# EAGLE design manual (EAGLE 4.16)
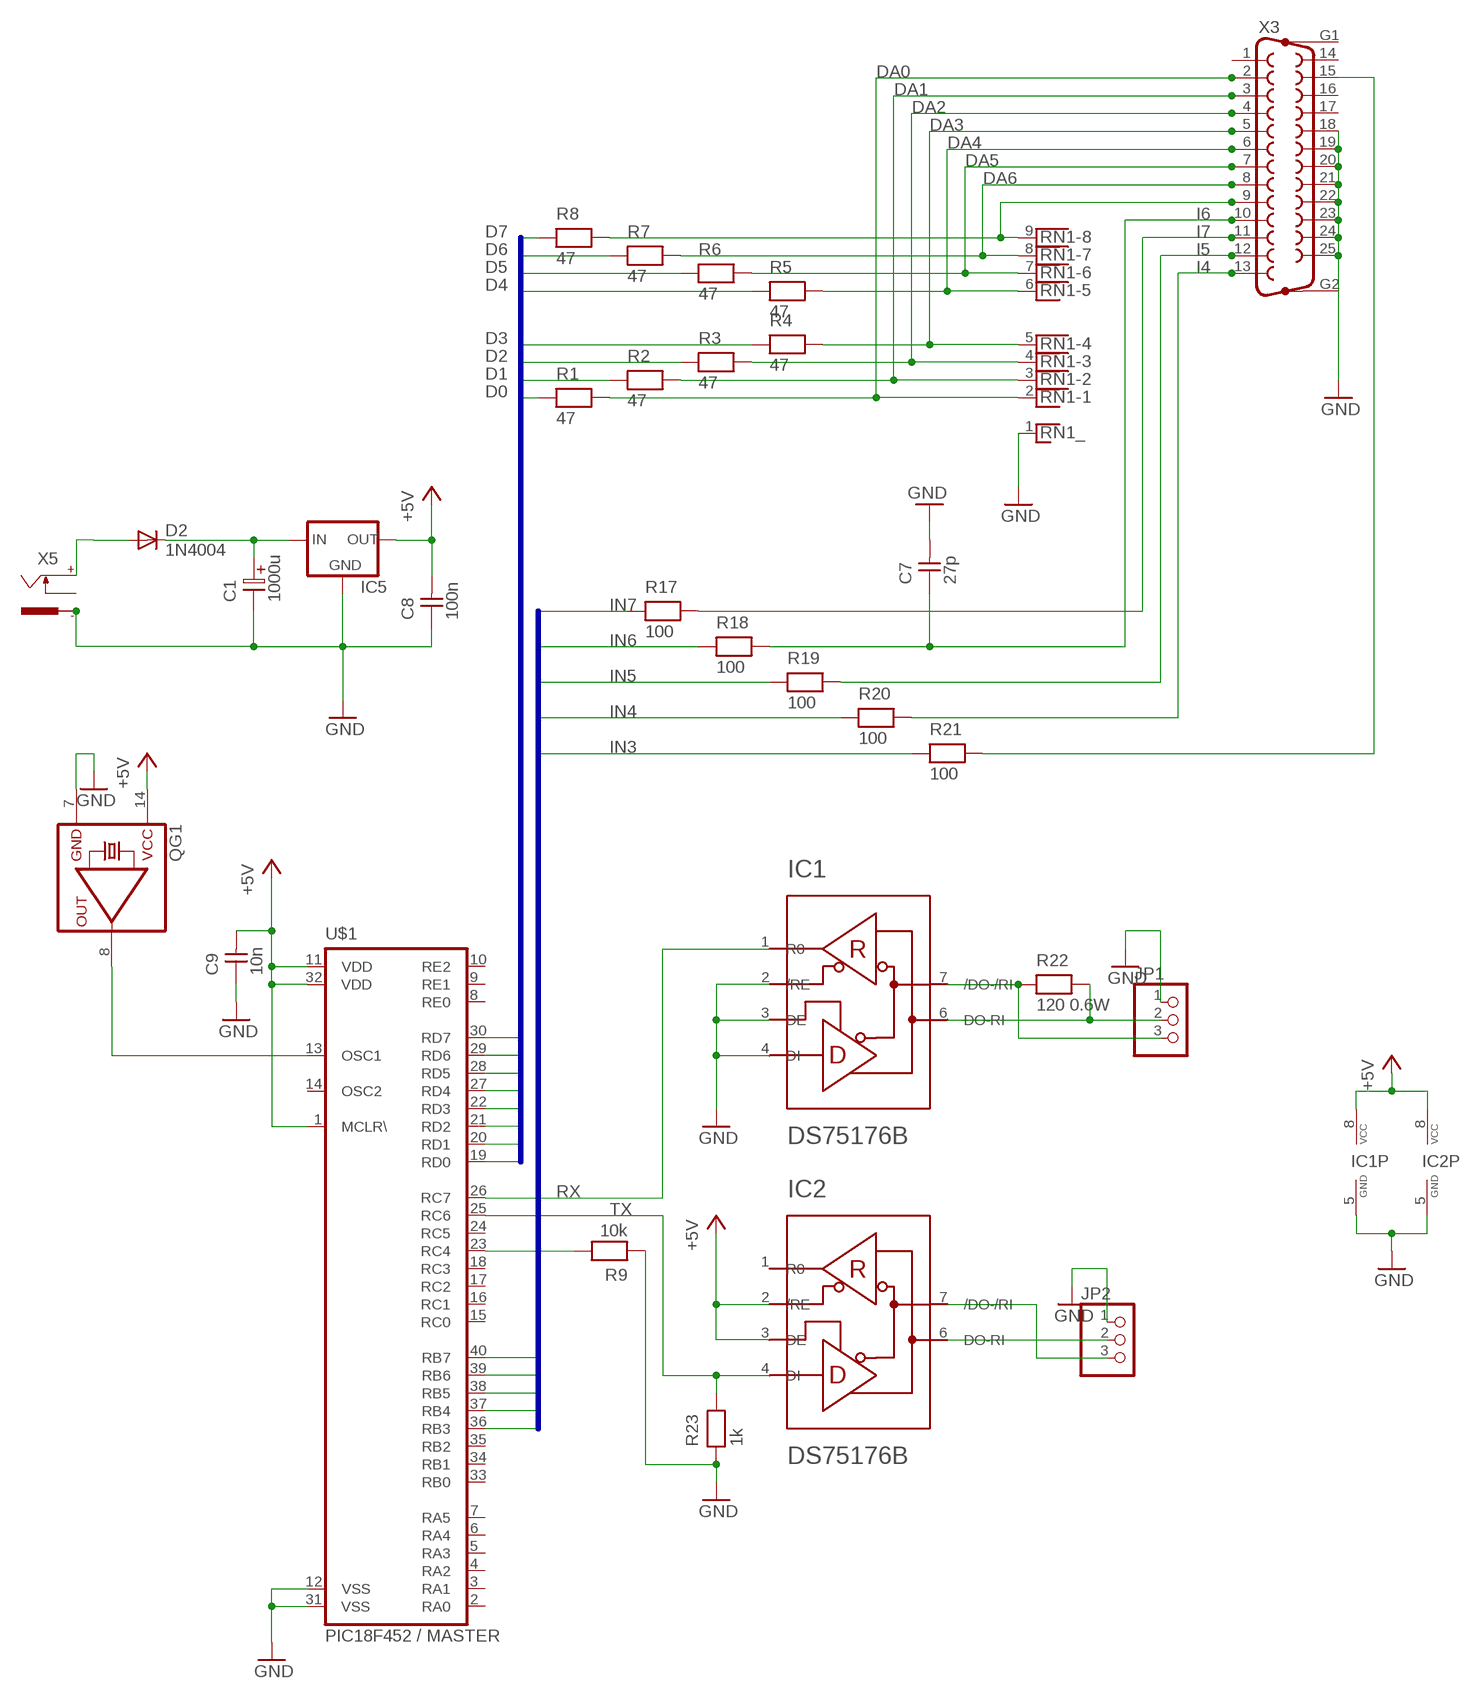
[diagram p0: schematic, sheet 1]

## Parts
C1  1000u  ELC-5  [ES-5]
C7  27p  CAPNP-2,5  [C-2,5]
C8  100n  CAPNP-2,5  [C-2,5]
C9  10n  CAPNP-2,5  [C-2,5]
D2  1N4004  [DO41-10]
IC1  DS75176B  [DIL08]
IC2  DS75176B  [DIL08]
IC5  78XXS  [78XXS]
JP1  PINHD-1X3  [1X03]
JP2  PINHD-1X3  [1X03]
QG1  QG5860  [DIL14S]
R1  47  RESEU-10  [R-10]
R2  47  RESEU-10  [R-10]
R3  47  RESEU-10  [R-10]
R4  47  RESEU-10  [R-10]
R5  47  RESEU-10  [R-10]
R6  47  RESEU-10  [R-10]
R7  47  RESEU-10  [R-10]
R8  47  RESEU-10  [R-10]
R9  10k  RESEU-10  [R-10]
R17  100  RESEU-10  [R-10]
R18  100  RESEU-10  [R-10]
R19  100  RESEU-10  [R-10]
R20  100  RESEU-10  [R-10]
R21  100  RESEU-10  [R-10]
R22  120 0.6W  RESEU-10  [R-10]
R23  1k  RESEU-10  [R-10]
RN1  RNX8  [RN-9]
U$1  PIC18F452 / MASTER  18F452  [DIL40]
X3  F25HP  [F25HP]
X5  737992-55  [737992-5]

## Nets
+5V: C8.2 C9.2 IC1.8(VCC) IC2.2(/RE) IC2.3(DE) IC2.8(VCC) IC5.OUT QG1.14(VCC) U$1.1(MCLR\) U$1.11(VDD) U$1.32(VDD)
D0: R1.1 U$1.19(RD0)
D1: R2.1 U$1.20(RD1)
D2: R3.1 U$1.21(RD2)
D3: R4.1 U$1.22(RD3)
D4: R5.1 U$1.27(RD4)
D5: R6.1 U$1.28(RD5)
D6: R7.1 U$1.29(RD6)
D7: R8.1 U$1.30(RD7)
DA0: R1.2 RN1.2 X3.2
DA1: R2.2 RN1.3 X3.3
DA2: R3.2 RN1.4 X3.4
DA3: R4.2 RN1.5 X3.5
DA4: R5.2 RN1.6 X3.6
DA5: R6.2 RN1.7 X3.7
DA6: R7.2 RN1.8 X3.8
DA7: R8.2 RN1.9 X3.9
GND: C1.2 C7.2 C8.1 C9.1 IC1.2(/RE) IC1.3(DE) IC1.4(DI) IC1.5(GND) IC2.5(GND) IC5.GND JP1.1 JP2.1 QG1.7(GND) R9.1 R23.1 RN1.1 U$1.12(VSS) U$1.31(VSS) X3.18 X3.19 X3.20 X3.21 X3.22 X3.23 X3.24 X3.25 X3.G2 X5.-1 X5.-2
I3: R21.2 X3.15
I4: R20.2 X3.13
I5: R19.2 X3.12
I6: C7.1 R18.2 X3.10
I7: R17.2 X3.11
IN3: R21.1 U$1.36(RB3)
IN4: R20.1 U$1.37(RB4)
IN5: R19.1 U$1.38(RB5)
IN6: R18.1 U$1.39(RB6)
IN7: R17.1 U$1.40(RB7)
N$1: IC1.6(DO-RI) JP1.2 R22.2
N$2: R9.2 U$1.23(RC4)
N$6: QG1.8(OUT) U$1.13(OSC1)
N$16: IC1.7(/DO-/RI) JP1.3 R22.1
N$18: C1.1 D2.C IC5.IN
N$19: D2.A X5.+
N$21: IC2.6(DO-RI) JP2.2
N$22: IC2.7(/DO-/RI) JP2.3
RX: IC1.1(R0) U$1.26(RC7)
TX: IC2.4(DI) R23.2 U$1.25(RC6)
Unconnected: IC2.1(R0) U$1.2(RA0) U$1.3(RA1) U$1.4(RA2) U$1.5(RA3) U$1.6(RA4) U$1.7(RA5) U$1.8(RE0) U$1.9(RE1) U$1.10(RE2) U$1.14(OSC2) U$1.15(RC0) U$1.16(RC1) U$1.17(RC2) U$1.18(RC3) U$1.24(RC5) U$1.33(RB0) U$1.34(RB1) U$1.35(RB2) X3.1 X3.14 X3.16 X3.17 X3.G1 X5.K

## Buses
D[0..7]
IN[3..7]

## Library data of the parts
C1 = discrete:ELC-5
C7-C9 = discrete:CAPNP-2,5
D2 = diode:1N4004: DIODE general purpose rectifier, 1 A
IC1 IC2 = oksid1:DS75176: RS485 TRANSEIVER
IC5 = v-reg:78XXS: VOLTAGE REGULATOR
JP1 JP2 = pinhead:PINHD-1X3: PIN HEADER
QG1 = crystal:QG5860: CRYSTAL RESONATOR
R1-R9 R17-R23 = discrete:RESEU-10
RN1 = resistor-net:RNX8: RESISTOR NETWORK
U$1 = oksid1:18F452: Microcontroller PIC18F452
X3 = con-subd:F25HP: SUB-D
X5 = con-conrad:737992-55: FEMALE PRINT CONNECTOR DIN 45323 (34V/3A), ROKA, distributor Conrad

## Net classes
0 signal: width 0.013 mm, drill 0.013 mm
1 power: width 0.025 mm, drill 0.025 mm

## Board
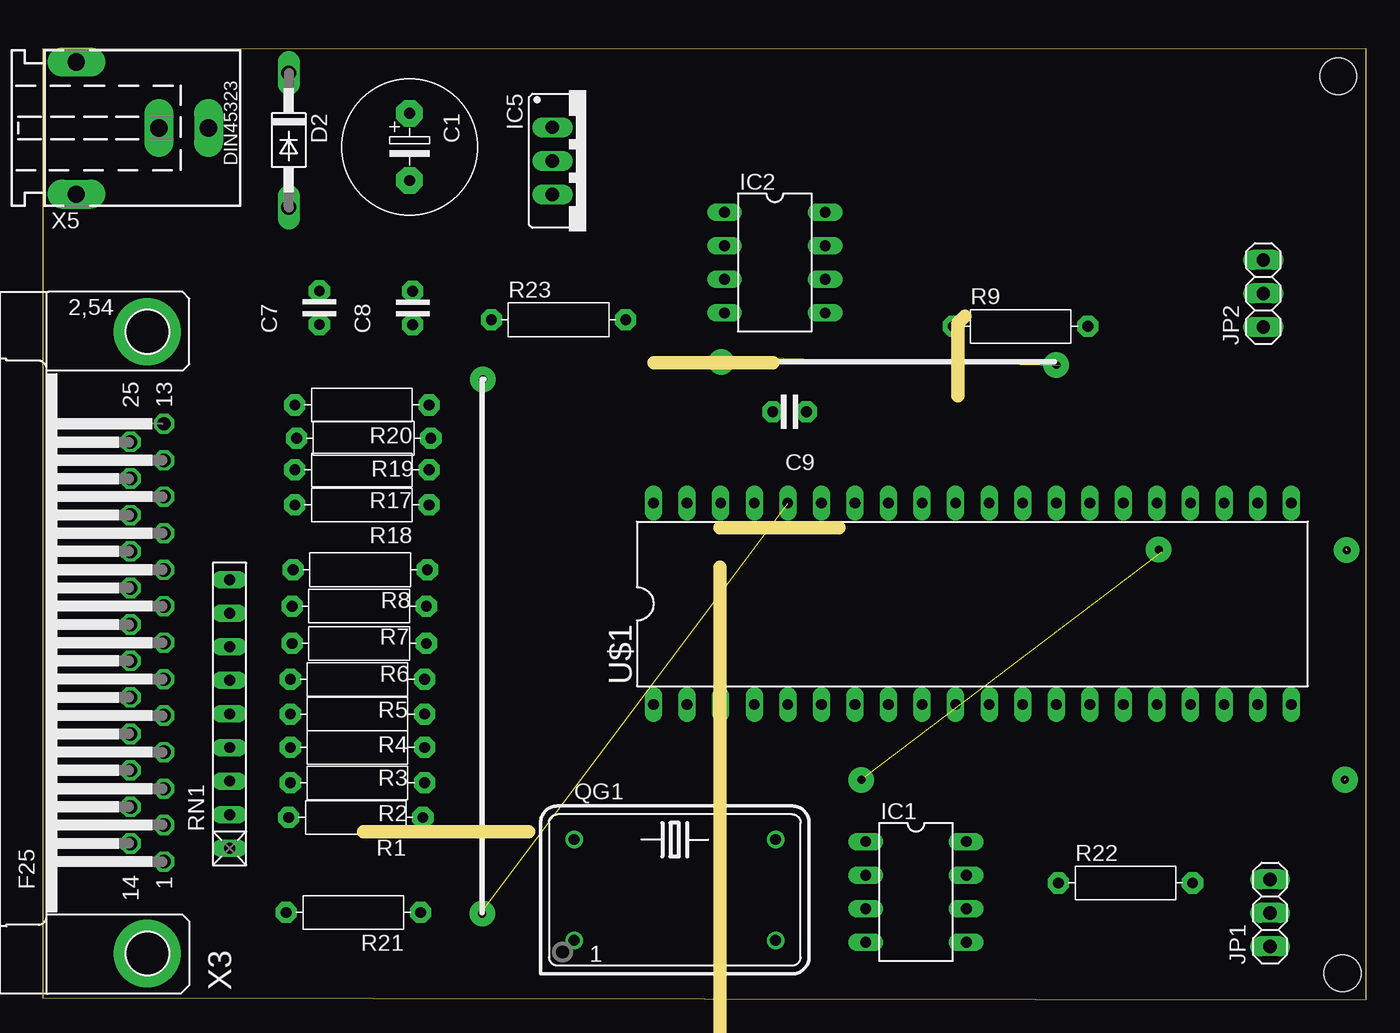
[diagram p1: board, top side]
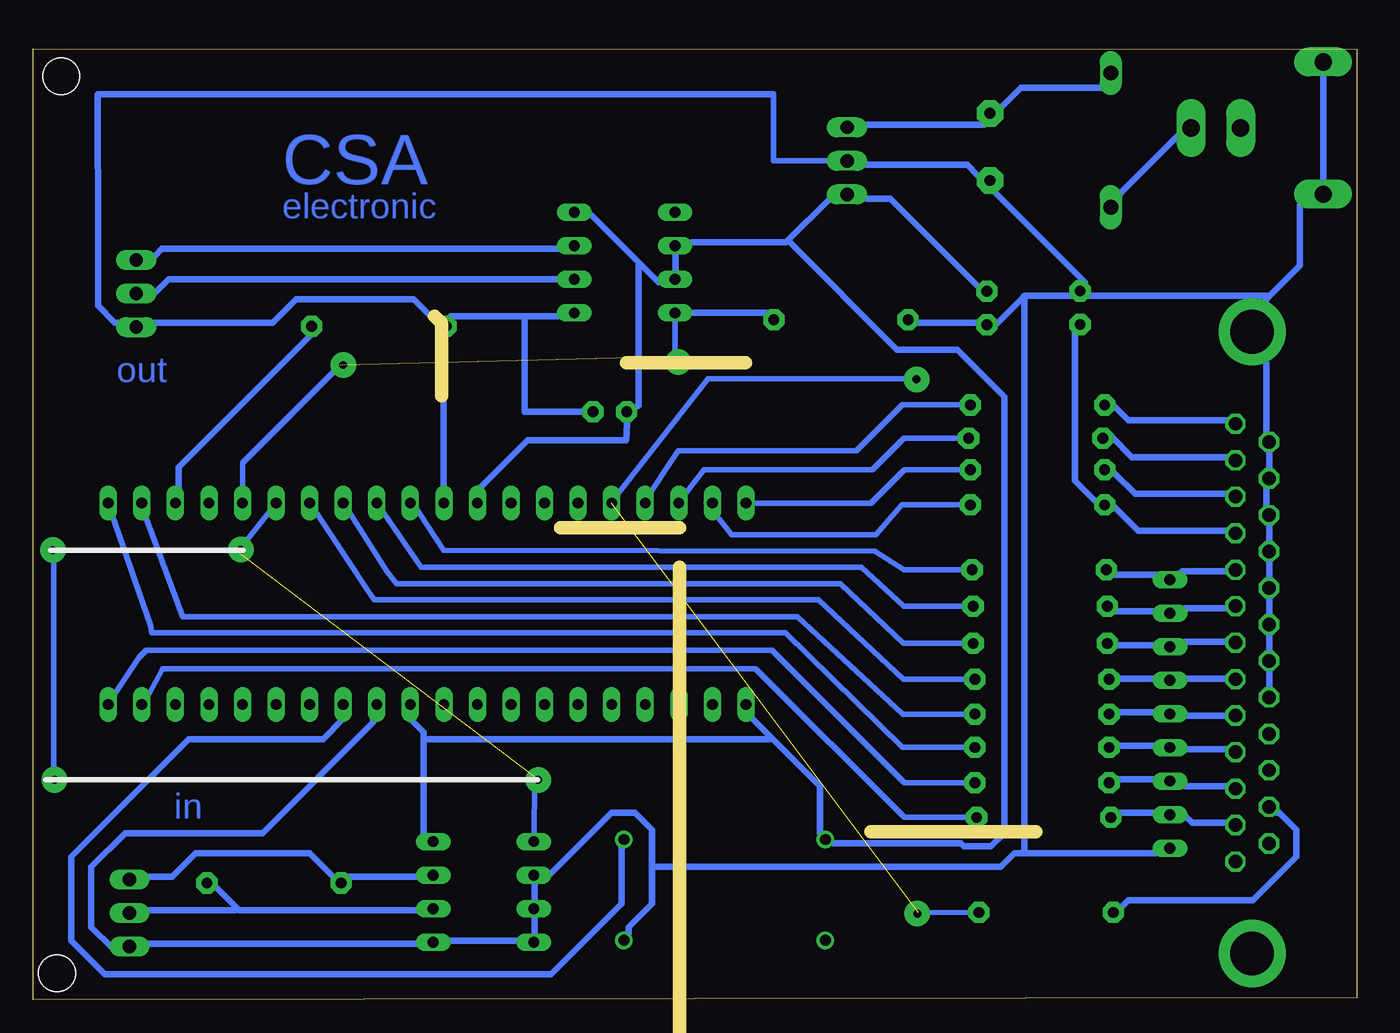
[diagram p2: board, bottom side, seen from below]

Size 100.18 x 71.95 mm. Coordinates in mm from the lower left corner, seen from the top.
Outline: 0,0.14 100.18,0 100.18,71.95 0.01,71.92 0,0.14
Copper layers (1*16): Top 0.035mm / dielectric 1.5mm / Bottom 0.035mm
Design rules "default": minimum track width 0.5mm, minimum drill 24mil, track to track 1mm, track to pad 1mm, pad to pad 1mm, via to via 1mm, smd to smd 8mil, copper to edge 40mil, drill to drill 8mil, minimum pad ring 10mil, minimum via ring 8mil, stop-mask expansion 4mil, vias tented up to drill 0mil, thermal gap 10mil
Holes 2.8 mm at 98.05,69.87 98.37,2
Milling: 7 lines

### Footprints (pad centres in the part's own frame; a part is rotated, then mirrored left to right if it is on the bottom)
ES-5 = drill 0.813 pad 2.007 octagon: 1 -2.54,0; 2 2.54,0
C-2,5 = drill 0.813 pad 1.6 octagon: 1 -1.27,0; 2 1.27,0
DO41-10 = drill 1.118 long: A 5.08,0; C -5.08,0
DIL08 = drill 0.813 long: 1 -3.81,-3.81; 2 -1.27,-3.81; 3 1.27,-3.81; 4 3.81,-3.81; 5 3.81,3.81; 6 1.27,3.81; 7 -1.27,3.81; 8 -3.81,3.81
78XXS = drill 1.016 long: GND 0,-2.54; IN -2.54,-2.54; OUT 2.54,-2.54
1X03 = drill 1.016 long: 1 -2.54,0; 2 0,0; 3 2.54,0
DIL14S = drill 0.813 round: 1 -7.62,-3.81; 7 7.62,-3.81; 8 7.62,3.81; 14 -7.62,3.81
R-10 = drill 0.813 pad 1.6 octagon: 1 -5.08,0; 2 5.08,0
RN-9 = drill 0.813 long: 1 -10.16,0; 2 -7.62,0; 3 -5.08,0; 4 -2.54,0; 5 0,0; 6 2.54,0; 7 5.08,0; 8 7.62,0; 9 10.16,0
DIL40 = drill 0.813 long: 1 -24.13,-7.62; 2 -21.59,-7.62; 3 -19.05,-7.62; 4 -16.51,-7.62; 5 -13.97,-7.62; 6 -11.43,-7.62; 7 -8.89,-7.62; 8 -6.35,-7.62; 9 -3.81,-7.62; 10 -1.27,-7.62; 11 1.27,-7.62; 12 3.81,-7.62; 13 6.35,-7.62; 14 8.89,-7.62; 15 11.43,-7.62; 16 13.97,-7.62; 17 16.51,-7.62; 18 19.05,-7.62; 19 21.59,-7.62; 20 24.13,-7.62; 21 24.13,7.62; 22 21.59,7.62; 23 19.05,7.62; 24 16.51,7.62; 25 13.97,7.62; 26 11.43,7.62; 27 8.89,7.62; 28 6.35,7.62; 29 3.81,7.62; 30 1.27,7.62; 31 -1.27,7.62; 32 -3.81,7.62; 33 -6.35,7.62; 34 -8.89,7.62; 35 -11.43,7.62; 36 -13.97,7.62; 37 -16.51,7.62; 38 -19.05,7.62; 39 -21.59,7.62; 40 -24.13,7.62
F25HP = drill 1.016 octagon: 1 -16.561,-1.27; 2 -13.792,-1.27; 3 -11.049,-1.27; 4 -8.28,-1.27; 5 -5.512,-1.27; 6 -2.769,-1.27; 7 0,-1.27; 8 2.769,-1.27; 9 5.512,-1.27; 10 8.28,-1.27; 11 11.049,-1.27; 12 13.792,-1.27; 13 16.561,-1.27; 14 -15.189,1.27; 15 -12.421,1.27; 16 -9.652,1.27; 17 -6.909,1.27; 18 -4.14,1.27; 19 -1.372,1.27; 20 1.372,1.27; 21 4.14,1.27; 22 6.909,1.27; 23 9.652,1.27; 24 12.421,1.27; 25 15.189,1.27 | drill 3.302 pad 5.08 round: G1 -23.52,0; G2 23.52,0
737992-5 = drill 1.3 pad 2.184 long: + 0,10; -1 5,0; -2 -5,0; K 0,6.25

### Placement (x,y rotation side)
C1  27.76,64.52 270 top
C7  20.93,52.35 90 top
C8  28,52.33 90 top
C9  56.52,44.48 180 top
D2  18.62,65.03 270 top
IC1  66.09,8.15 270 top
IC2  55.41,55.77 270 top
IC5  41.12,63.46 270 top
JP1  92.88,6.57 90 top
JP2  92.38,53.43 90 top
QG1  47.84,8.31 0 top
R1  23.69,13.79 180 top
R2  23.82,16.41 180 top
R3  23.82,19.09 180 top
R4  23.82,21.61 180 top
R5  23.82,24.23 180 top
R6  23.95,26.96 180 top
R7  23.95,29.77 180 top
R8  24.03,32.53 180 top
R9  74.01,50.94 0 top
R17  24.16,40.08 180 top
R18  24.16,37.43 180 top
R19  24.29,42.47 180 top
R20  24.16,44.99 180 top
R21  23.51,6.6 180 top
R22  81.94,8.83 0 top
R23  39.04,51.44 0 top
RN1  14.14,21.62 90 top
U$1  70.36,29.95 0 top
X3  7.91,27.01 90 top
X5  2.54,65.95 270 top

### Tracks (layer width: path | path; a pad name or v marks a point on that pad's centre or on a via)
+5V
  Bottom 0.5: 70.61,19.72 70.61,20.23 71.63,21.24 U$1.11 | 70.61,19.72 70.61,12.61 IC1.8 | 44.33,19.84 45.72,21.24 U$1.1 | 44.33,19.84 40.64,16.16 40.64,12.61 QG1.14 39.63,11.84 29.98,11.84 29.72,11.59 27.69,11.59 26.67,12.61 26.67,45.63 30.23,49.18 34.8,49.18 43.06,57.44 | 70.61,19.72 44.45,19.72 44.33,19.84 | U$1.32 66.3,38.77 62.74,42.32 55.29,42.32 55.24,43.5 C9.2 54.37,44.94 54.37,50.02 54.36,50.96 54.36,55.53 54.23,55.66 | 54.23,55.66 52.84,54.26 IC2.3 51.57,55.02 51.57,56.55 IC2.2 50.3,57.31 43.18,57.31 43.06,57.44 | 54.23,55.66 57.92,59.34 IC2.8 | C8.2 28.7,54.01 35.31,60.61 37.09,60.61 IC5.OUT 39.88,60.61 43.06,57.44
D0
  Bottom 0.406: R1.1 34.25,13.79 45.51,25.05 90.32,25.05 90.41,24.96 91.9,22.25 U$1.19
D1
  Bottom 0.406: R2.1 34.23,16.41 44.27,26.45 91.63,26.45 92.16,25.92 94.43,22.51 U$1.20
D2
  Bottom 0.406: R3.1 34.38,19.09 43.24,27.77 91.2,27.76 91.28,28.28 94.52,37.64 U$1.21
D3
  Bottom 0.406: R4.1 34.36,21.61 42.35,28.99 88.84,28.99 91.98,37.46 U$1.22
D4
  Bottom 0.406: R5.1 34.3,24.23 40.75,30.26 74.37,30.26 74.94,31.08 79.14,37.46 U$1.27
D5
  Bottom 0.406: R6.1 34.32,26.96 39.07,31.45 72.68,31.45 73.37,32.39 76.69,37.55 U$1.28
D6
  Bottom 0.406: R7.1 34.28,29.77 37.5,32.72 70.82,32.72 74.16,37.55 U$1.29
D7
  Bottom 0.406: R8.1 34.27,32.53 36.46,33.94 69.11,33.99 71.53,37.72 U$1.30
DA0
  Bottom 0.5: R1.2 18.04,14.13 15.24,14.13 RN1.2 12.96,13.88 12.45,13.37 9.91,13.37 X3.2
DA1
  Bottom 0.5: R2.2 18.04,16.67 15.24,16.67 RN1.3 12.96,16.16 9.91,16.16 X3.3
DA2
  Bottom 0.5: R3.2 18.04,19.21 15.24,19.21 RN1.4 12.96,18.96 9.91,18.96 X3.4
DA3
  Bottom 0.5: R4.2 18.04,21.75 15.24,21.75 RN1.5 12.96,21.5 9.91,21.5 X3.5
DA4
  Bottom 0.5: R5.2 18.04,24.29 15.24,24.29 RN1.6 12.96,24.29 9.91,24.29 X3.6
DA5
  Bottom 0.5: R6.2 18.29,26.83 15.24,26.83 RN1.7 12.96,27.08 9.91,27.08 X3.7
DA6
  Bottom 0.5: R7.2 18.29,29.37 15.24,29.37 RN1.8 12.96,29.62 9.91,29.62 X3.8
DA7
  Bottom 0.5: R8.2 18.29,32.16 15.24,32.16 RN1.9 13.21,32.42 9.91,32.42 X3.9
GND
  Bottom 0.406: 44.16,68.53 44.16,68.52 | 44.16,68.52 44.18,68.52 | IC5.GND 44.16,63.46 44.16,68.52
  Bottom 0.5: U$1.12 74.42,21.24 74.42,20.99 82.81,12.61 93.22,12.61 95.76,10.07 95.76,5.49 94.24,3.97 JP1.1 91.44,4.22 71.12,4.22 IC1.5 68.58,4.48 63.5,4.48 IC1.4 62.23,4.99 62.23,6.26 IC1.3 62.23,7.53 62.23,8.8 IC1.2 60.96,9.56 56.39,14.13 54.61,14.13 53.34,12.86 53.34,10.07 | 53.34,10.07 53.34,7.27 55.12,5.49 55.12,4.99 QG1.7 | 25.15,11.08 25.91,11.08 26.93,10.07 53.34,10.07 | 25.15,11.08 15.24,11.08 RN1.1 | U$1.31 69.09,38.77 69.09,50.2 R9.1 | 63,51.72 68.58,51.72 R9.1 | 63,51.72 60.46,51.72 IC2.5 | R9.1 69.6,51.21 71.38,52.99 80.27,52.99 82.05,51.21 90.94,51.21 JP2.1 93.73,51.21 93.98,51.21 95.25,52.48 95.25,57.14 95.3,68.5 44.18,68.52 | 63,51.72 62.99,44.49 C9.1 | IC5.GND 37.09,63.15 29.47,63.15 28.7,62.39 C1.2 27.43,61.12 20.58,54.26 C7.2 | R23.1 33.28,51.21 28.7,51.21 C8.1 27.43,50.96 25.28,53.12 | 25.28,53.12 25.15,53.25 21.59,53.25 C7.2 | X3.18 6.61,23.53 6.61,25.05 X3.19 6.61,26.32 6.61,27.85 X3.20 6.61,29.12 6.61,30.64 X3.21 6.61,31.91 6.61,33.18 X3.22 6.61,34.45 6.61,35.97 X3.23 6.86,37.24 6.86,38.77 X3.24 6.61,40.04 6.61,41.56 X3.25 6.86,42.83 6.86,48.17 X3.G2 6.86,52.99 6.73,53.12 | X5.-2 X5.-1 4.32,60.1 4.32,55.53 6.73,53.12 | C7.2 20.32,53.25 6.86,53.25 6.73,53.12 | 25.15,11.08 25.15,52.99 25.28,53.12
I3
  Bottom 0.5: X3.15 6.1,14.13 5.84,14.13 4.58,12.86 4.58,10.83 7.88,7.53 17.27,7.53 17.78,7.02 R21.2
I4
  Bottom 0.5: X3.13 9.91,43.85 17.27,43.85 18.29,44.86 R20.2
I5
  Bottom 0.5: X3.12 9.91,41.05 17.02,41.05 18.54,42.58 R19.2
I6
  Bottom 0.5: X3.10 9.91,35.47 16.51,35.47 18.29,37.24 R18.2 19.82,37.75 21.34,39.28 21.34,50.45 C7.1
I7
  Bottom 0.5: X3.11 9.91,38.26 16.77,38.26 18.29,39.78 R17.2
IN3  (1 unrouted)
  Bottom 0.406: 33.22,46.97 40.18,46.96 49.11,46.96 56.48,37.54 U$1.36 | R21.1 33.18,6.58
IN4
  Bottom 0.406: R20.1 34.4,44.99 37.87,41.52 51.34,41.52 51.4,41.46 54.02,37.51 U$1.37
IN5
  Bottom 0.406: R19.1 34.29,42.47 36.67,40.09 49.41,40.09 51.39,37.54 U$1.38
IN6
  Bottom 0.406: R18.1 34.41,37.43 36.4,35.18 47.33,35.18 47.42,35.28 49.25,37.64 U$1.39
IN7
  Bottom 0.406: R17.1 34.22,40.08 36.77,37.54 46.28,37.54 | 46.28,37.54 46.25,37.57 U$1.40 | 46.28,37.54 46.5,37.32
N$1
  Bottom 0.5: 84.71,6.89 86.36,8.54 R22.2 | 84.71,6.89 84.58,6.76 71.12,6.76 IC1.6 | JP1.2 91.44,6.76 84.84,6.76 84.71,6.89
N$2
  Bottom 0.5: U$1.23 89.16,38.77 89.16,40.29 79.25,50.2 R9.2
N$3  (via drill 0.6 pad 1.93)
  other vias: 33.25,6.5
N$4  (via drill 0.6 pad 1.93)
  other vias: 33.31,46.92
N$6
  Bottom 0.5: QG1.8 55.63,11.59 55.63,7.27 60.96,1.94 94.74,1.94 97.28,4.48 97.28,10.83 88.39,19.72 78.23,19.72 76.71,21.24 U$1.13
N$7  (via drill 0.6 pad 1.93)
  other vias: 61.95,16.63
N$8  (via drill 0.6 pad 1.93)  (2 unrouted)
  Bottom 0.406: 98.61,16.7 98.61,34.12
  other vias: 98.55,16.64 98.68,34.01
N$10  (via drill 0.6 pad 1.93)
  other vias: 84.46,34.04
N$11  (via drill 0.6 pad 1.93)
  other vias: 51.34,48.26
N$12  (via drill 0.6 pad 1.93)
  other vias: 76.7,48.01
N$16
  Bottom 0.5: IC1.7 71.12,9.3 76.46,9.3 R22.1 77.47,9.3 79.25,11.08 87.89,11.08 89.66,9.3 91.44,9.3 JP1.3
N$18
  Bottom 0.5: IC5.IN 37.09,66.2 28.2,66.2 C1.1 26.93,67.47 25.4,68.99 19.31,68.99 D2.C
N$19
  Bottom 0.5: D2.A 17.78,61.12 13.46,65.44 X5.+
N$21
  Bottom 0.5: IC2.6 60.46,54.52 89.92,54.52 90.94,53.5 JP2.2
N$22
  Bottom 0.5: IC2.7 60.46,56.8 90.43,56.8 90.94,56.29 JP2.3
RX  (1 unrouted)
  Bottom 0.406: IC1.1 62.24,16.85 | U$1.26 84.68,33.9
TX  (1 unrouted)
  Bottom 0.406: U$1.25 84.33,40.63 76.94,48.01 | IC2.4 51.6,48.64 51.09,48.14
  Bottom 0.5: IC2.4 50.3,51.98 44.71,51.98 R23.2

### Text on the board
Bottom: CSA | electronic | out | in